# Altium schematic sheet 01 - BLOCK DIAGRAM.SchDoc
size 420 x 297 mm; Organization: ToyBuilder Labs; Address1: 2736 E Walnut St; Address2: Pasadena, California 91107; Address4: +1 (626) 808-4010; DocumentNumber: 2; SheetNumber: 2; SheetTotal: 4
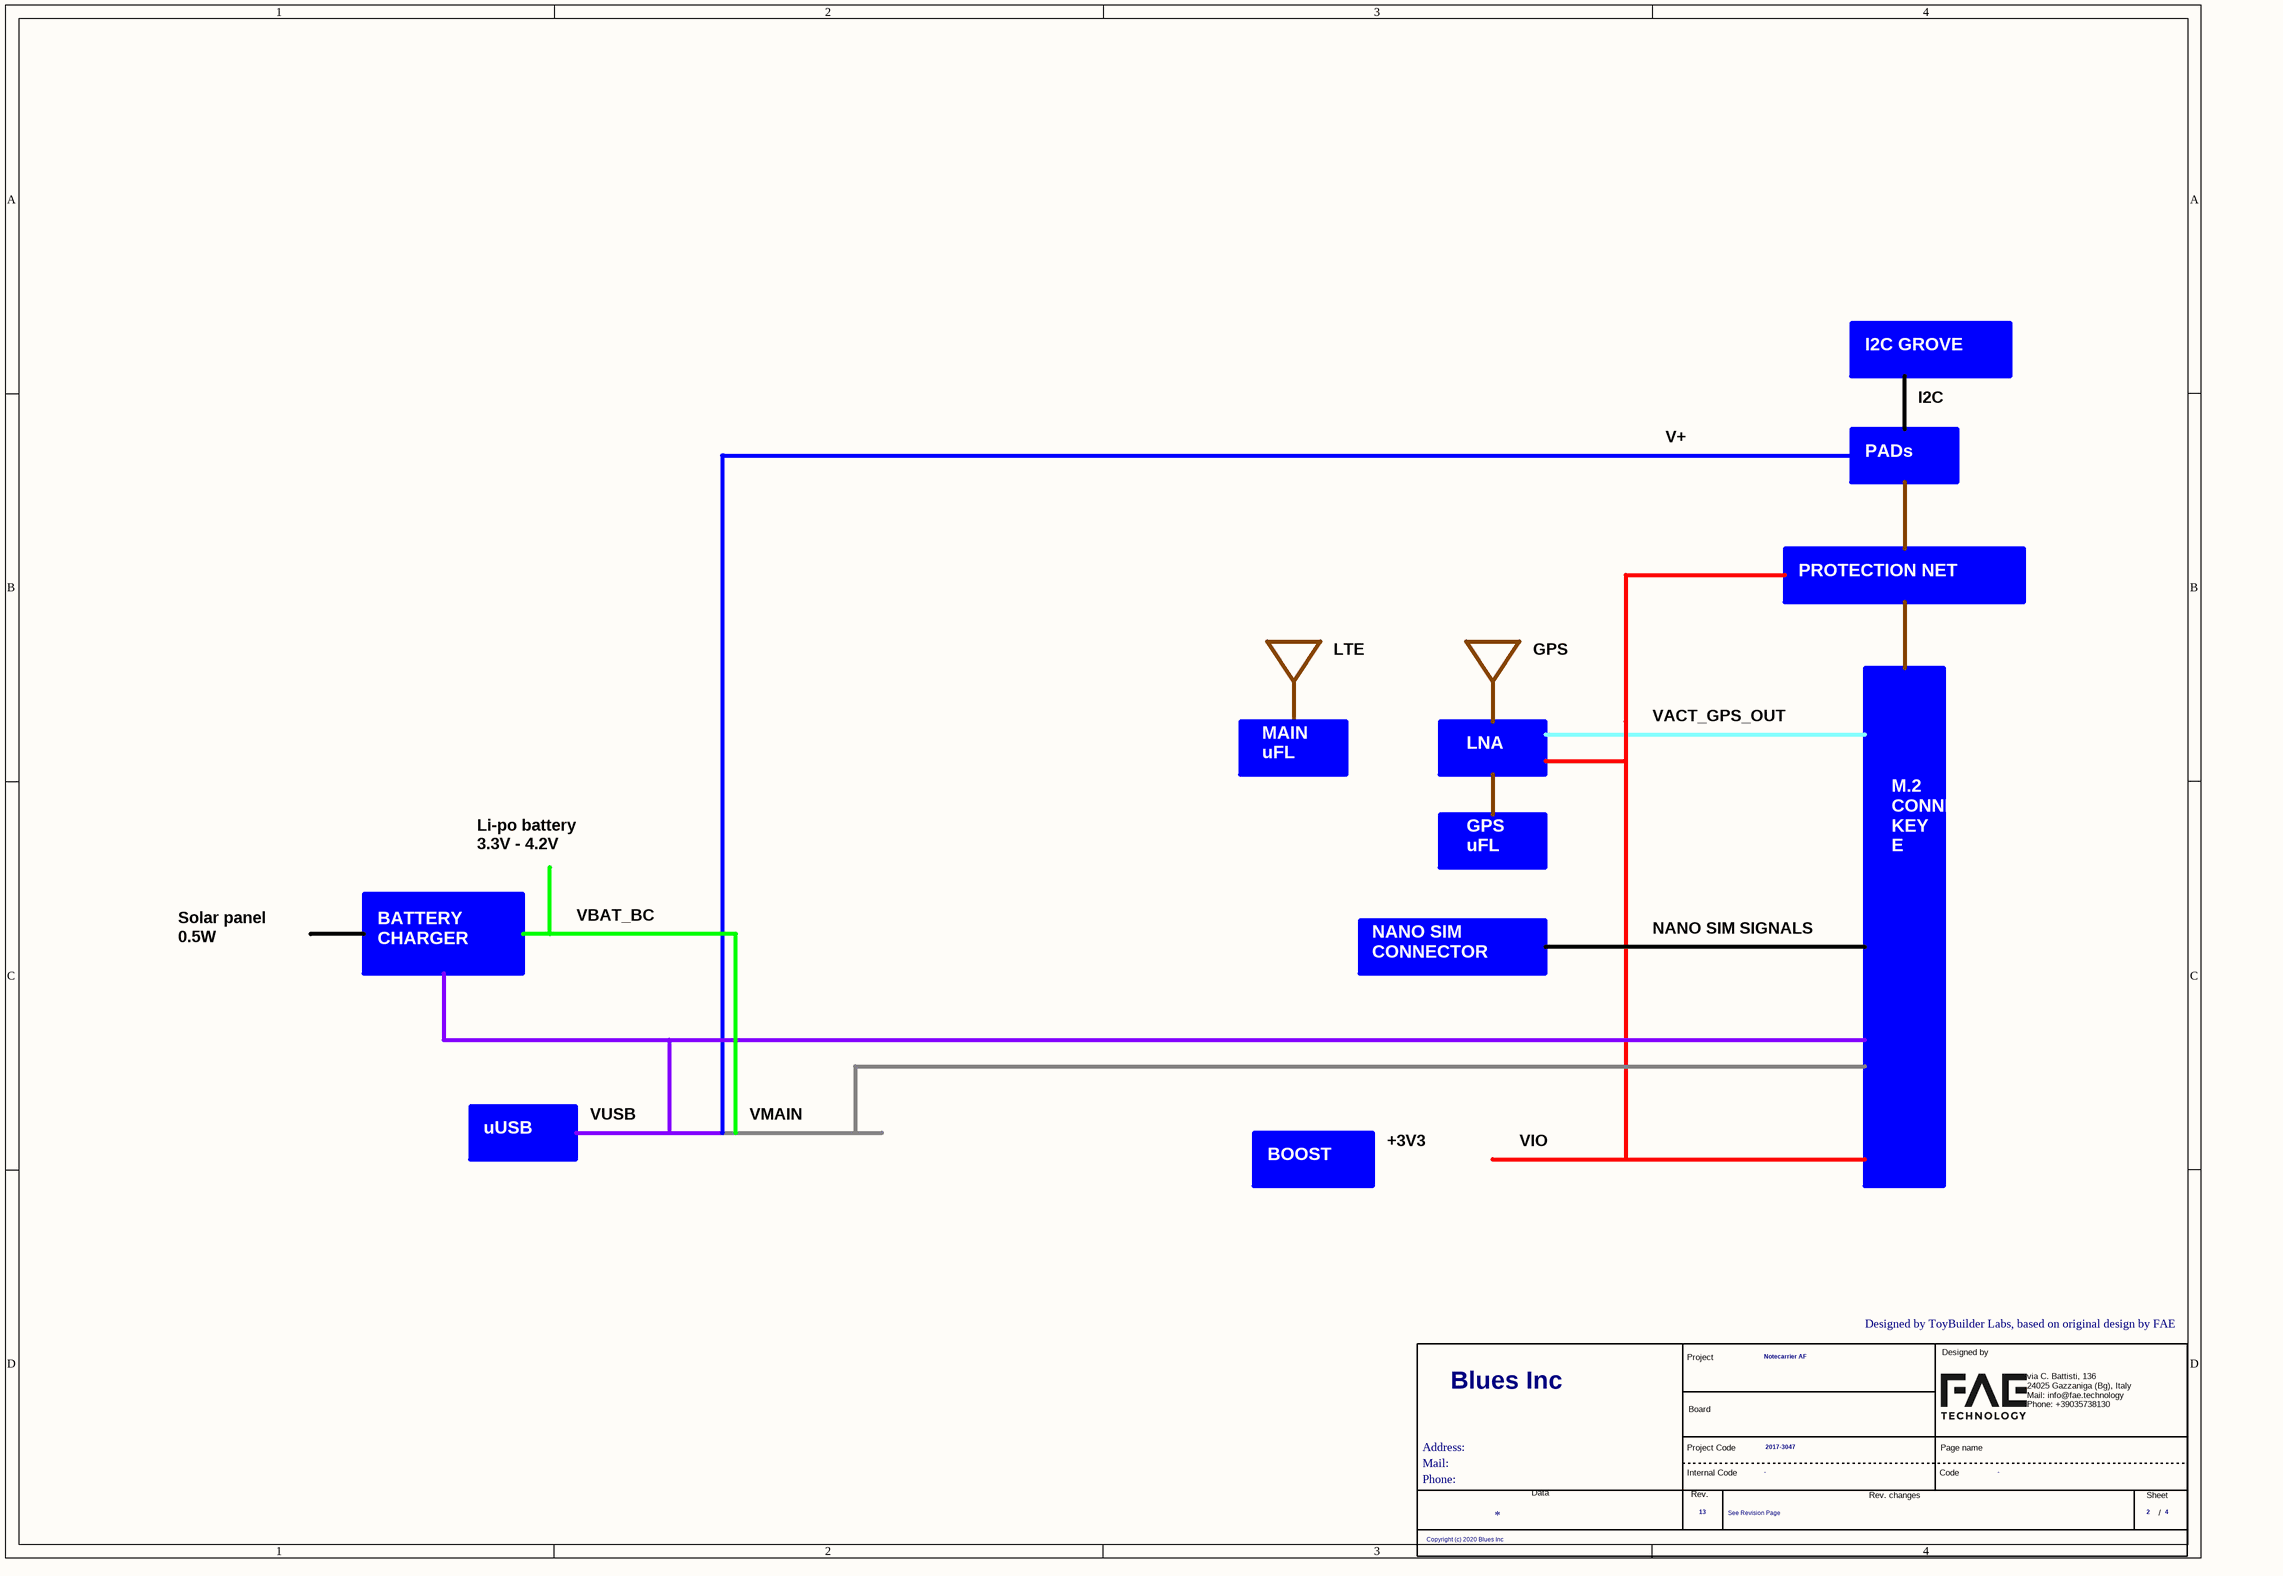
[diagram p0: 01 - BLOCK DIAGRAM.SchDoc]

## Parts
*  Address: Address:  Copyright: Copyright (c) 2020 Blues Inc  CustomerName: Blues Inc  DocumentoRev: See Revision Page  Mail: Mail:  Nome Progetto: Notecarrier AF  Page Count: 4  Page Number: 2  Phone: Phone:  Project Code: 2017-3047  Revision: 13  (hidden comment: MyBlues)  (graphical)

## Notes on the sheet
- I2C GROVE
- V+
- I2C
- PADs
- PROTECTION NET
- LTE
- GPS
- VACT_GPS_OUT
- MAIN
  uFL
- LNA
- Li-po battery
  3.3V - 4.2V
- VBAT_BC
- GPS
  uFL
- Solar panel
  0.5W
- BATTERY
  CHARGER
- NANO SIM
  CONNECTOR
- NANO SIM SIGNALS
- VUSB
- VMAIN
- M.2 CONNECTOR KEY E
- uUSB
- BOOST
- +3V3
- VIO
- Designed by ToyBuilder Labs, based on original design by FAE
- Title
- Size:
- Date:
- B
- Number:
- Time:
- Revision:
- Sheet
- of
- File:
- (in symbol MyBlues) Designed by; Project; Board; via C. Battisti, 136 / 24025 Gazzaniga (Bg), Italy / Mail: info@fae.technology / Phone: +39035738130; Project Code; Page name; Internal Code; Code; Data; Rev.; Rev. changes; Sheet; /

## Library data of the parts
* = MyBlues: Customer Code: -; Database: -; Page Modify Date: *; Customer name: Blues Inc; FAE RD code: 2017-3047